# EAGLE schematic RHD2164-L-SS4-AmpAccel (EAGLE 9.3.2)

## Sheet 1 of 2: Vertical
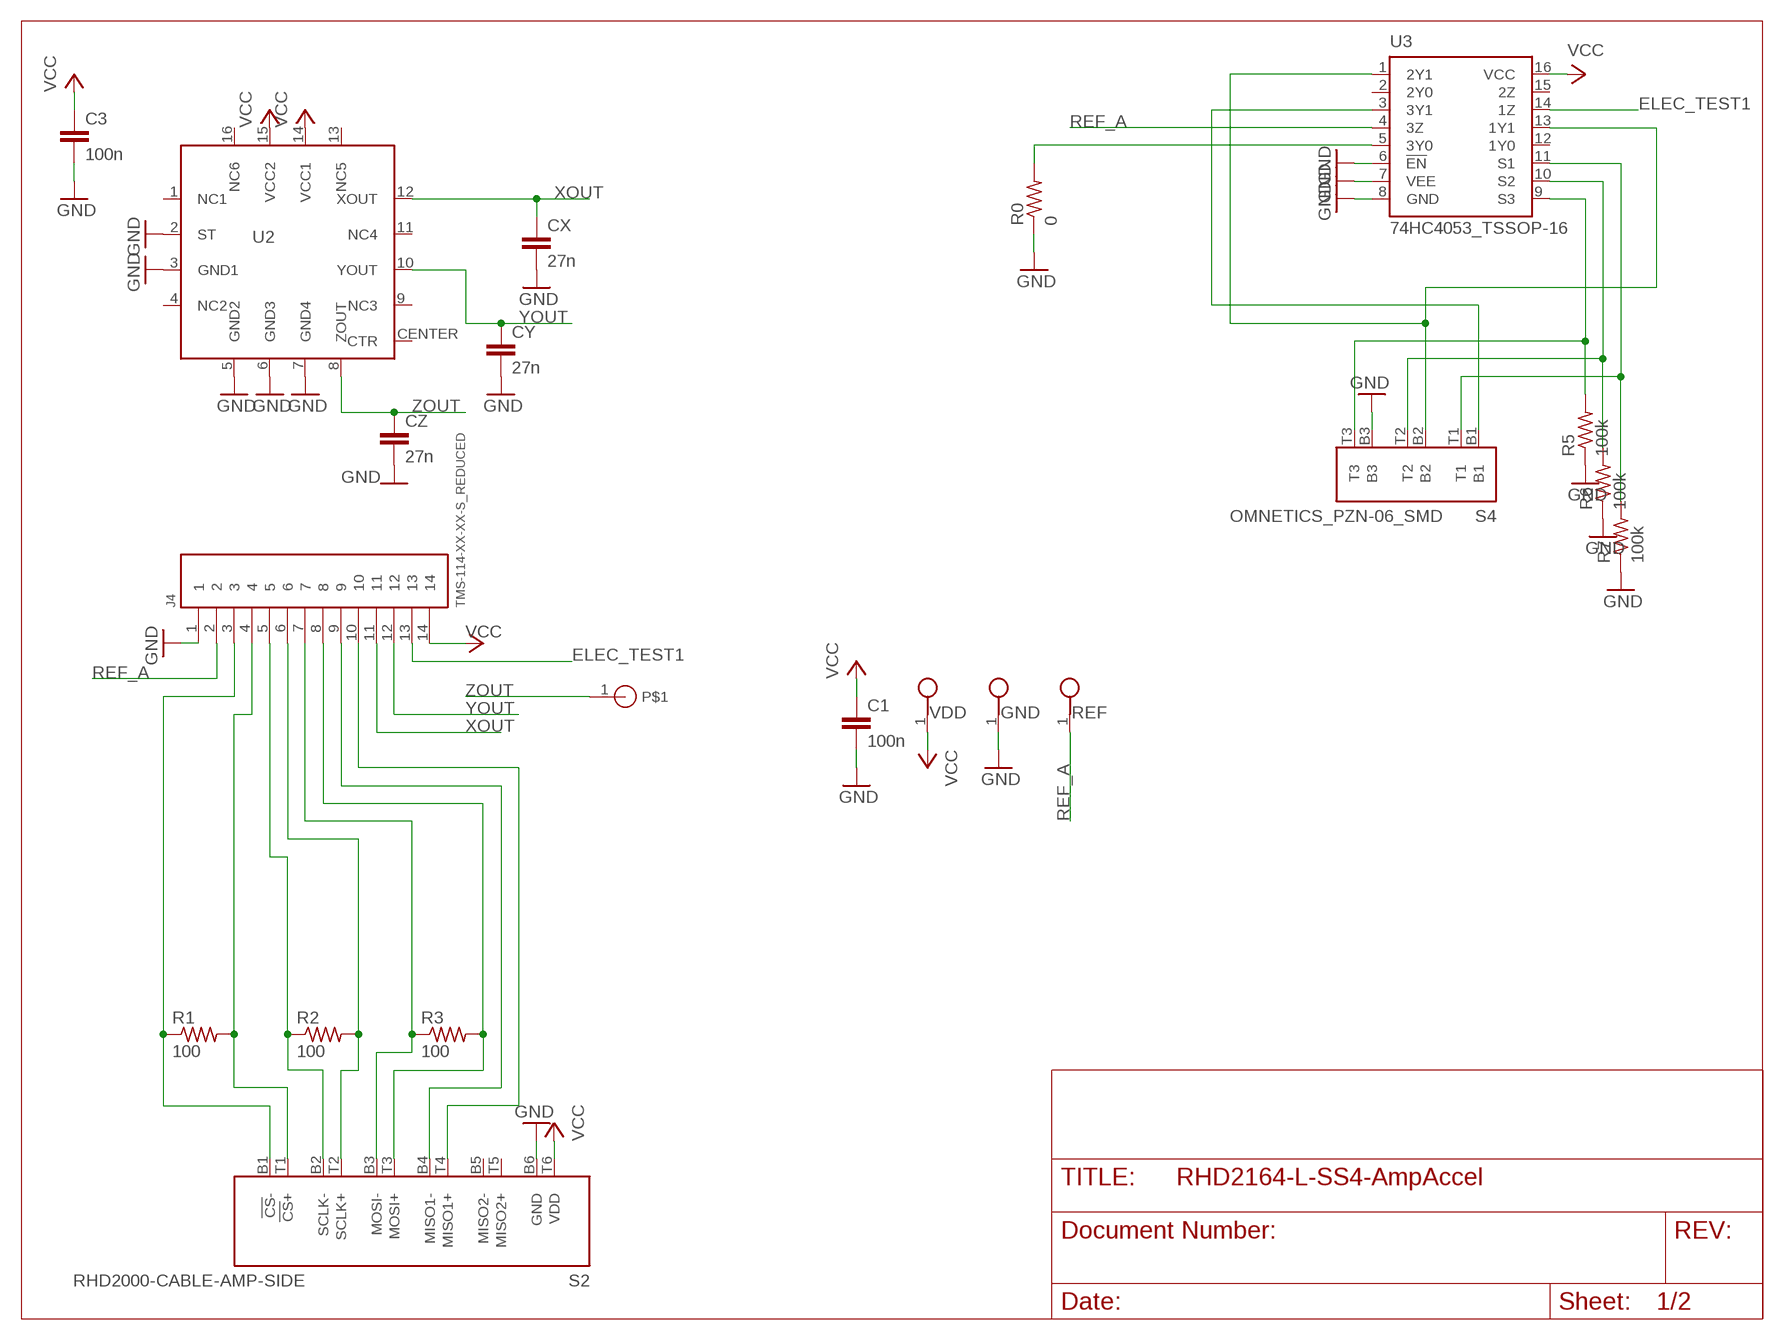
[diagram p0: schematic, sheet 1]

### Parts
C1  100n  C_0402  [0402]
C3  100n  C_0402  [0402]
CX  27n  C_0402  [0402]
CY  27n  C_0402  [0402]
CZ  27n  C_0402  [0402]
GND  TESTPOINT_SMALL  [TESTPOINT_SMALL]
J4  TMS-114-XX-XX-S_REDUCED  [TMS-114-XX-XX-S_REDUCED]
R0  0  R_0402  [0402]
R1  100  R_0201  [0201]
R2  100  R_0201  [0201]
R3  100  R_0201  [0201]
R5  100k  R_0201  [0201]
R6  100k  R_0201  [0201]
R7  100k  R_0201  [0201]
REF  TESTPOINT_SMALL  [TESTPOINT_SMALL]
S2  RHD2000-CABLE-AMP-SIDE  [OMNETICS_PZN-12-AA]
S4  OMNETICS_PZN-06_SMD  [OMNETICS_PZN-06-AA]
U2  ADXL335_IDAX  [ADXL335_IDAX]
U3  74HC4053_TSSOP-16  [TSSOP-16]
U$1  PIN_HOLE  [PIN_HOLE]
VDD  TESTPOINT_SMALL  [TESTPOINT_SMALL]

### Nets
CS-: J4.3 R1.1 S2.B1(!CS!-)
ELEC_TEST1: J4.13 U3.14(1Z)
GND [thick]: C1.2 C3.2 CX.2 CY.2 CZ.2 GND.1 J4.1 R0.1 R5.1 R6.1 R7.1 S2.B6(GND) S4.B3 U2.2(ST) U2.3(GND1) U2.5(GND2) U2.6(GND3) U2.7(GND4) U3.6(!EN!) U3.7(VEE) U3.8(GND)
N$11 [thick]: R0.2 U3.5(3Y0)
N$35: J4.4 R1.2 S2.T1(!CS!+)
N$36: J4.5 R2.1 S2.B2(SCLK-)
N$37: J4.6 R2.2 S2.T2(SCLK+)
N$38: J4.7 R3.1 S2.B3(MOSI-)
N$39: J4.8 R3.2 S2.T3(MOSI+)
N$40: J4.9 S2.B4(MISO1-)
N$81: J4.10 S2.T4(MISO1+)
N$131: R7.2 S4.T1 U3.11(S1)
N$132: R6.2 S4.T2 U3.10(S2)
N$133: R5.2 S4.T3 U3.9(S3)
N$135 [thick]: S4.B1 U3.3(3Y1)
N$136: S4.B2 U3.1(2Y1) U3.13(1Y1)
REF_A: J4.2 REF.1 U3.4(3Z)
VCC [thick]: C1.1 C3.1 J4.14 S2.T6(VDD) U2.14(VCC1) U2.15(VCC2) U3.16(VCC) VDD.1
XOUT: CX.1 J4.11 U2.12(XOUT)
YOUT: CY.1 J4.12 U2.10(YOUT)
ZOUT: CZ.1 U2.8(ZOUT) U$1.1
Unconnected: S2.B5(MISO2-) S2.T5(MISO2+) U2.1(NC1) U2.4(NC2) U2.9(NC3) U2.11(NC4) U2.13(NC5) U2.16(NC6) U2.CENTER(CTR) U3.2(2Y0) U3.12(1Y0) U3.15(2Z)

## Sheet 2 of 2: Horizontal
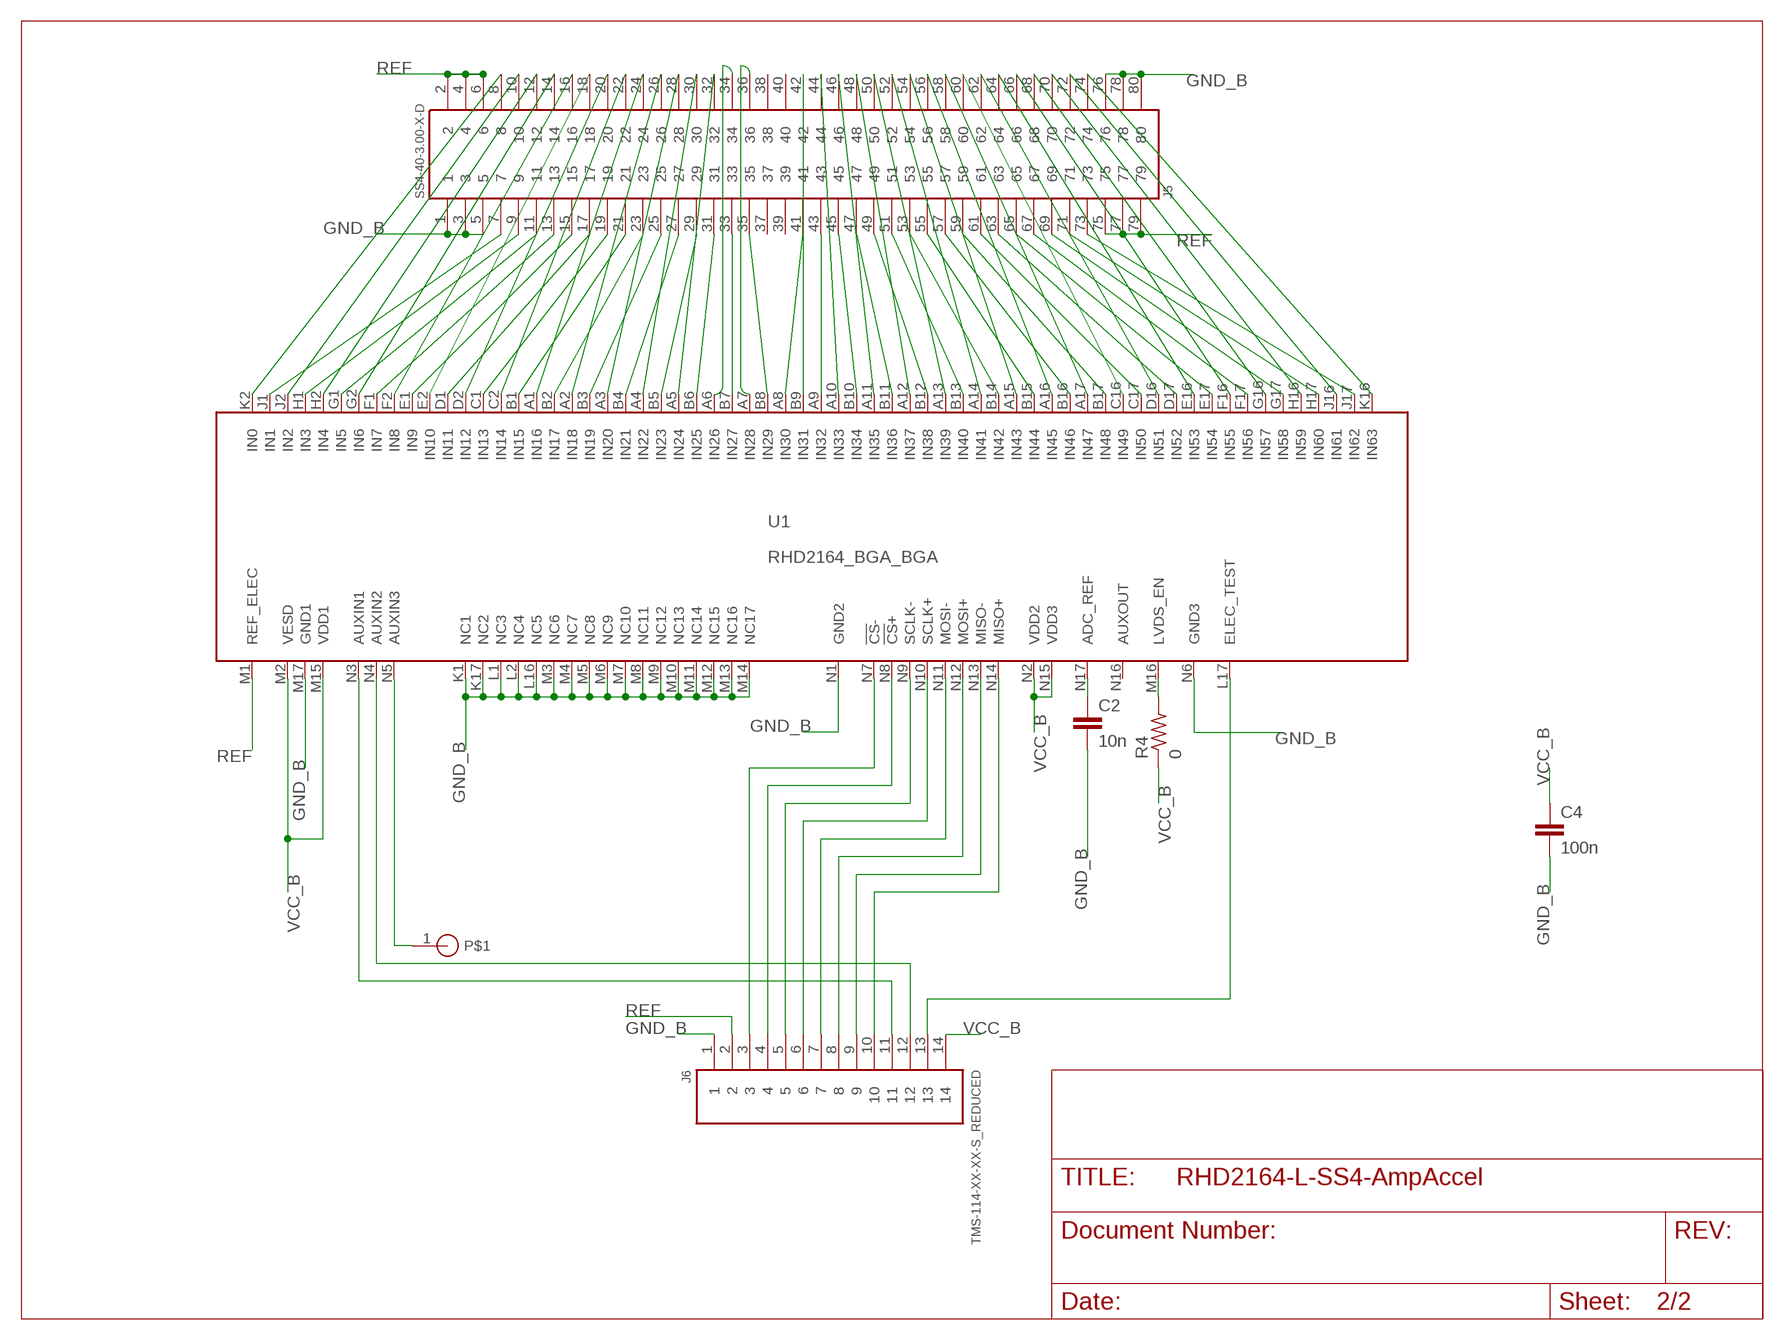
[diagram p1: schematic, sheet 2]

### Parts
C2  10n  C_0201  [0201]
C4  100n  C_0402  [0402]
J5  SS4-40-3.00-X-D  [SS4-40-3.00-X-D]
J6  TMS-114-XX-XX-S_REDUCED  [TMS-114-XX-XX-S_REDUCED]
R4  0  R_0402  [0402]
U1  RHD2164_BGA_BGA  [BGA104_9X7]
U$2  PIN_HOLE  [PIN_HOLE]

### Nets
GND_B [thick]: C2.2 C4.2 J5.1 J5.3 J5.5 J5.76 J5.78 J5.80 J6.1 U1.K1(NC1) U1.K17(NC2) U1.L1(NC3) U1.L2(NC4) U1.L16(NC5) U1.M3(NC6) U1.M4(NC7) U1.M5(NC8) U1.M6(NC9) U1.M7(NC10) U1.M8(NC11) U1.M9(NC12) U1.M10(NC13) U1.M11(NC14) U1.M12(NC15) U1.M13(NC16) U1.M14(NC17) U1.M17(GND1) U1.N1(GND2) U1.N6(GND3)
N$1: C2.1 U1.N17(ADC_REF)
N$2: J5.8 U1.K2(IN0)
N$3: J5.7 U1.J1(IN1)
N$4: J5.10 U1.J2(IN2)
N$5: J5.9 U1.H1(IN3)
N$6: J5.12 U1.H2(IN4)
N$7: J5.11 U1.G1(IN5)
N$8: J5.14 U1.G2(IN6)
N$9: J5.13 U1.F1(IN7)
N$10: J6.4 U1.N8(!CS!+)
N$13: J6.6 U1.N10(SCLK+)
N$15: J6.8 U1.N12(MOSI+)
N$16: J6.9 U1.N13(MISO-)
N$17: J6.10 U1.N14(MISO+)
N$18: J5.16 U1.F2(IN8)
N$19: J5.15 U1.E1(IN9)
N$20: J5.18 U1.E2(IN10)
N$21: J5.17 U1.D1(IN11)
N$22: J5.20 U1.D2(IN12)
N$23: J5.19 U1.C1(IN13)
N$24: J5.22 U1.C2(IN14)
N$25: J5.21 U1.B1(IN15)
N$26: J5.24 U1.A1(IN16)
N$27: J5.23 U1.B2(IN17)
N$28: J5.26 U1.A2(IN18)
N$29: J5.25 U1.B3(IN19)
N$30: J5.74 U1.K16(IN63)
N$31: J5.73 U1.J17(IN62)
N$32: J5.72 U1.J16(IN61)
N$33: J5.71 U1.H17(IN60)
N$34: J5.70 U1.H16(IN59)
N$41: J5.69 U1.G17(IN58)
N$42: R4.2 U1.M16(LVDS_EN)
N$43: J5.68 U1.G16(IN57)
N$44: J5.67 U1.F17(IN56)
N$45: J5.66 U1.F16(IN55)
N$46: J5.65 U1.E17(IN54)
N$47: J5.64 U1.E16(IN53)
N$48: J5.63 U1.D17(IN52)
N$49: J5.62 U1.D16(IN51)
N$50: J5.61 U1.C17(IN50)
N$51: J5.60 U1.C16(IN49)
N$52: J5.59 U1.B17(IN48)
N$53: J5.58 U1.A17(IN47)
N$54: J5.57 U1.B16(IN46)
N$55: J5.56 U1.A16(IN45)
N$56: J5.55 U1.B15(IN44)
N$57: J5.54 U1.A15(IN43)
N$58: J5.53 U1.B14(IN42)
N$59: J5.52 U1.A14(IN41)
N$60: J5.51 U1.B13(IN40)
N$61: J5.28 U1.A3(IN20)
N$62: J5.27 U1.B4(IN21)
N$63: J5.30 U1.A4(IN22)
N$64: J5.29 U1.B5(IN23)
N$65: J5.32 U1.A5(IN24)
N$66: J5.31 U1.B6(IN25)
N$67: J5.34 U1.A6(IN26)
N$68: J5.33 U1.B7(IN27)
N$69: J5.50 U1.A13(IN39)
N$70: J5.49 U1.B12(IN38)
N$71: J5.48 U1.A12(IN37)
N$72: J5.47 U1.B11(IN36)
N$73: J5.46 U1.A11(IN35)
N$74: J5.45 U1.B10(IN34)
N$75: J5.44 U1.A10(IN33)
N$76: J5.43 U1.A9(IN32)
N$77: J5.42 U1.B9(IN31)
N$78: J5.41 U1.A8(IN30)
N$79: J5.36 U1.A7(IN28)
N$80: J5.35 U1.B8(IN29)
N$82: J6.13 U1.L17(ELEC_TEST)
N$83: J6.11 U1.N3(AUXIN1)
N$84: J6.12 U1.N4(AUXIN2)
N$85: U1.N5(AUXIN3) U$2.1
N$86: J6.3 U1.N7(!CS!-)
N$87: J6.5 U1.N9(SCLK-)
N$88: J6.7 U1.N11(MOSI-)
REF [thick]: J5.2 J5.4 J5.6 J5.75 J5.77 J5.79 J6.2 U1.M1(REF_ELEC)
VCC_B: C4.1 J6.14 R4.1 U1.M2(VESD) U1.M15(VDD1) U1.N2(VDD2) U1.N15(VDD3)
Unconnected: J5.37 J5.38 J5.39 J5.40 U1.N16(AUXOUT)

## Library data of the parts
C1-C4 CX CY CZ = RHD2000_eval_board:C: Capacitor
GND REF VDD = RHD2000_eval_board:TESTPOINT: PCB Test Point
J4 J6 = TMS-108+114-XX-XX-S:TMS-114-XX-XX-S_REDUCED: 050" x .100" .018" Square Post Terminal Strip.
J5 = SS4-40-3.00-X-D_custom:SS4-40-3.00-X-D: 0.4MM SOCKET STRIP ASSEMBLY
R0 R1-R7 = RHD2000_eval_board:R: Resistor
S2 = RHD2000:RHD2000-CABLE-AMP-SIDE: Omnetics A79623 PZN-12-AA connector for SPI interface (amplifier side)
S4 = RHD2000:OMNETICS_PZN-06
U1 = INTAN:RHD2164_BGA: Intan Technologies RHD2164 chip, BGA package (9x7mm 104-pin)
U2 = harrison:ADXL335
U3 = harrison:74HC4053
U$1 U$2 = Various:PIN_HOLE

## Net classes
1 thick: width 0.102 mm
2 power: width 0.61 mm